# EAGLE design MonoMixer (EAGLE 7.5.0)
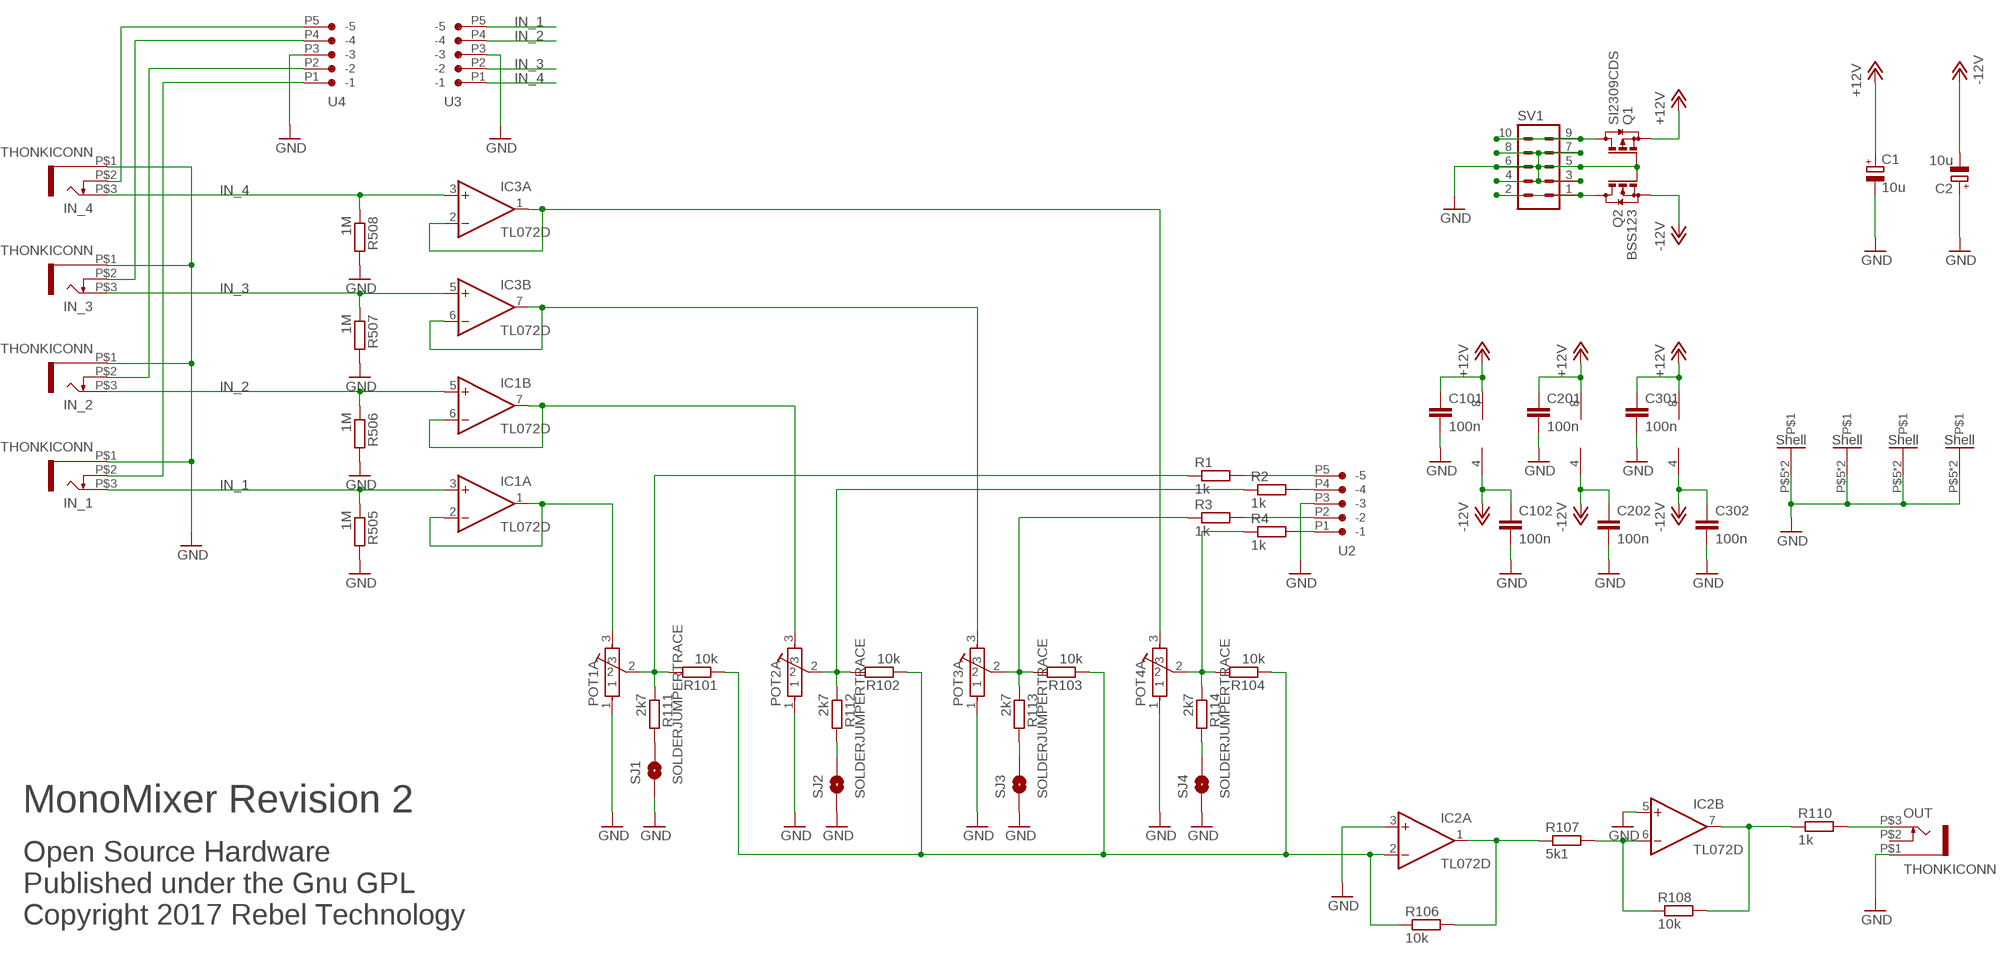
[diagram p0: schematic, sheet 1]

## Parts
C1  10u  CPOL-EU153CLV-0505  [153CLV-0505]
C2  10u  CPOL-EU153CLV-0505  [153CLV-0505]
C101  100n  C-EUC0603  [C0603]
C102  100n  C-EUC0603  [C0603]
C201  100n  C-EUC0603  [C0603]
C202  100n  C-EUC0603  [C0603]
C301  100n  C-EUC0603  [C0603]
C302  100n  C-EUC0603  [C0603]
IC1  TL072D  [SO08]
IC2  TL072D  [SO08]
IC3  TL072D  [SO08]
IN_1  THONKICONN  [THONKICONN]
IN_2  THONKICONN  [THONKICONN]
IN_3  THONKICONN  [THONKICONN]
IN_4  THONKICONN  [THONKICONN]
OUT  THONKICONN  [THONKICONN]
POT1A  POT-ALPS-RK09L1140  [POT-ALPS-RK09L1140]
POT2A  POT-ALPS-RK09L1140  [POT-ALPS-RK09L1140]
POT3A  POT-ALPS-RK09L1140  [POT-ALPS-RK09L1140]
POT4A  POT-ALPS-RK09L1140  [POT-ALPS-RK09L1140]
Q1  SI2309CDS  BSS84  [SOT23]
Q2  BSS123  [SOT23]
R1  1k  R-EU_R0603  [R0603]
R2  1k  R-EU_R0603  [R0603]
R3  1k  R-EU_R0603  [R0603]
R4  1k  R-EU_R0603  [R0603]
R101  10k  R-EU_R0603  [R0603]
R102  10k  R-EU_R0603  [R0603]
R103  10k  R-EU_R0603  [R0603]
R104  10k  R-EU_R0603  [R0603]
R106  10k  R-EU_R0603  [R0603]
R107  5k1  R-EU_R0603  [R0603]
R108  10k  R-EU_R0603  [R0603]
R110  1k  R-EU_R0603  [R0603]
R111  2k7  R-EU_R0603  [R0603]
R112  2k7  R-EU_R0603  [R0603]
R113  2k7  R-EU_R0603  [R0603]
R114  2k7  R-EU_R0603  [R0603]
R505  1M  R-EU_R0603  [R0603]
R506  1M  R-EU_R0603  [R0603]
R507  1M  R-EU_R0603  [R0603]
R508  1M  R-EU_R0603  [R0603]
SJ1  SOLDERJUMPERTRACE  [SJ_2S-TRACE]
SJ2  SOLDERJUMPERTRACE  [SJ_2S-TRACE]
SJ3  SOLDERJUMPERTRACE  [SJ_2S-TRACE]
SJ4  SOLDERJUMPERTRACE  [SJ_2S-TRACE]
SV1  MA05-2  [MA05-2]
U2  CON-JST_PH_5W  [CON-JST_PH_5W]
U3  CON-JST_PH_5W  [CON-JST_PH_5W]
U4  CON-JST_PH_5W  [CON-JST_PH_5W]

## Nets
+12V: C1.+ C101.1 C201.1 C301.1 IC1.8(P:V+) IC2.8(P:V+) IC3.8(P:V+) Q1.2(S)
-12V: C2.- C102.1 C202.1 C302.1 IC1.4(P:V-) IC2.4(P:V-) IC3.4(P:V-) Q2.2(S)
GND: C1.- C2.+ C101.2 C102.2 C201.2 C202.2 C301.2 C302.2 IC2.3(A:+IN) IC2.5(B:+IN) IN_1.P$1 IN_2.P$1 IN_3.P$1 IN_4.P$1 OUT.P$1 POT1A.1 POT1A.P$5 POT1A.P$6 POT2A.1 POT2A.P$5 POT2A.P$6 POT3A.1 POT3A.P$5 POT3A.P$6 POT4A.1 POT4A.P$5 POT4A.P$6 Q1.1(G) Q2.1(G) R505.2 R506.2 R507.2 R508.2 SJ1.1 SJ2.1 SJ3.1 SJ4.1 SV1.3 SV1.4 SV1.5 SV1.6 SV1.7 SV1.8 U2.P3(-3) U3.P3(-3) U4.P3(-3)
IN_1: IC1.3(A:+IN) IN_1.P$3 R505.1 U3.P5(-5)
IN_2: IC1.5(B:+IN) IN_2.P$3 R506.1 U3.P4(-4)
IN_3: IC3.5(B:+IN) IN_3.P$3 R507.1 U3.P2(-2)
IN_4: IC3.3(A:+IN) IN_4.P$3 R508.1 U3.P1(-1)
IN_SW_1: IN_1.P$2 U4.P1(-1)
IN_SW_2: IN_2.P$2 U4.P2(-2)
IN_SW_3: IN_3.P$2 U4.P4(-4)
IN_SW_4: IN_4.P$2 U4.P5(-5)
N$1: Q2.3(D) SV1.1 SV1.2
N$2: R1.2 U2.P5(-5)
N$3: R2.2 U2.P4(-4)
N$4: R3.2 U2.P2(-2)
N$5: R4.2 U2.P1(-1)
N$6: IC2.7(B:OUT) R108.2 R110.1
N$9: OUT.P$3 R110.2
N$11: IC2.2(A:-IN) R101.1 R102.1 R103.1 R104.1 R106.1
N$13: IC2.1(A:OUT) R106.2 R107.1
N$14: Q1.3(D) SV1.9 SV1.10
N$17: R111.2 SJ1.2
N$18: IC2.6(B:-IN) R107.2 R108.1
N$22: R112.2 SJ2.2
N$24: R113.2 SJ3.2
N$25: R114.2 SJ4.2
N$29: POT1A.2 R1.1 R101.2 R111.1
N$35: IC3.1(A:OUT) IC3.2(A:-IN) POT4A.3
N$36: IC3.6(B:-IN) IC3.7(B:OUT) POT3A.3
N$37: IC1.6(B:-IN) IC1.7(B:OUT) POT2A.3
N$38: IC1.1(A:OUT) IC1.2(A:-IN) POT1A.3
N$47: POT4A.2 R4.1 R104.2 R114.1
N$49: POT3A.2 R3.1 R103.2 R113.1
N$51: POT2A.2 R2.1 R102.2 R112.1
Unconnected: OUT.P$2

## Notes on the sheet
- MonoMixer Revision 2
- Open Source Hardware
  Published under the Gnu GPL
  Copyright 2017 Rebel Technology

## Library data of the parts
C1 C2 = rcl:CPOL-EU: POLARIZED CAPACITOR, European symbol
C101 C102 C201 C202 C301 C302 = resistor:C-EU: CAPACITOR, European symbol
IC1-IC3 = linear:TL072: OP AMP
IN_1-IN_4 OUT = Rebel:THONKICONN
POT1A POT2A POT3A POT4A = Rebel:POT-ALPS-RK09L
Q1 = transistor-small-signal:BSS84: P-CHANNEL MOS FET
Q2 = transistor-small-signal:BSS123: N-CHANNEL MOS FET
R1-R4 R101-R104 R106-R108 R110-R114 R505-R508 = resistor:R-EU_: RESISTOR, European symbol
SJ1-SJ4 = SparkFun:SOLDERJUMPER: Solder Jumper Standard SMD solder jumper. Used to automate production. Two varients : Normally Open and Normally Closed are the same, but have different paste layers. NC will have a large amount of paste and should jumper during reflow.
SV1 = con-lstb:MA05-2: PIN HEADER; OC_FARNELL: unknown; OC_NEWARK: unknown
U2-U4 = Rebel:CON-JST_PH_5W

## Board
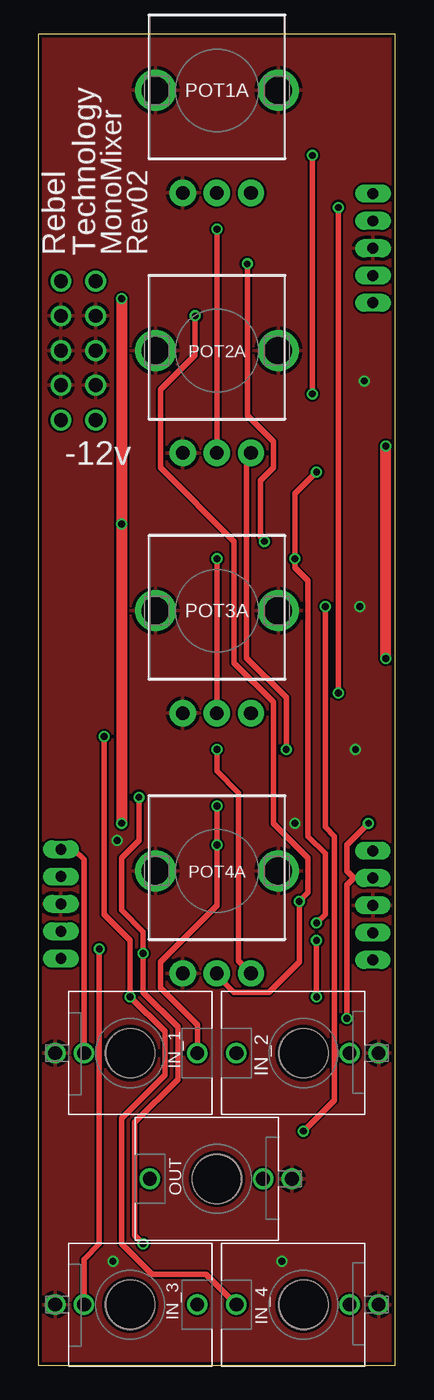
[diagram p1: board, top side]
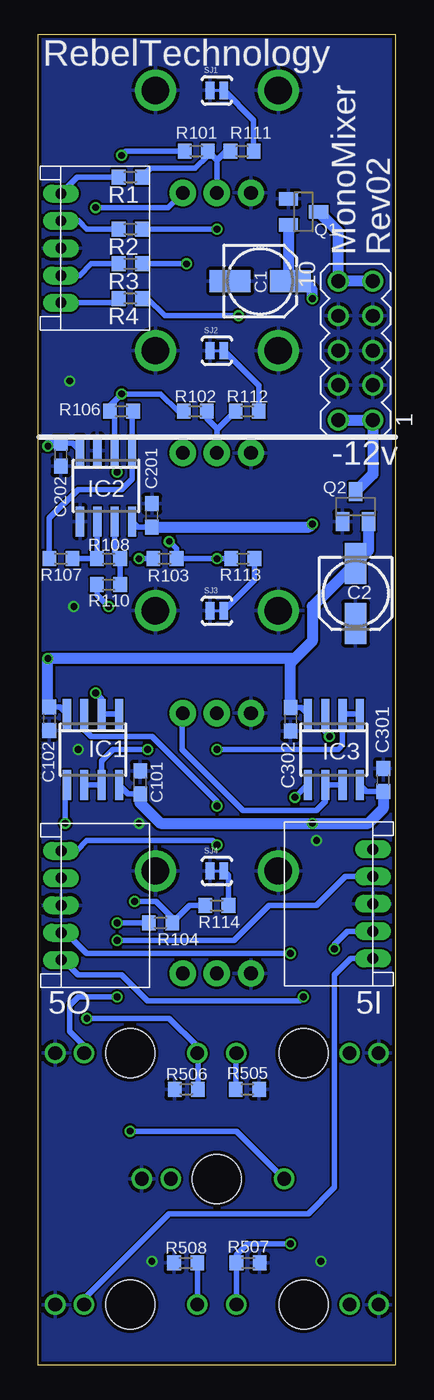
[diagram p2: board, bottom side, seen from below]

Size 26.16 x 97.46 mm. Coordinates in mm from the lower left corner, seen from the top.
Outline: 26.16,0 26.16,97.46 0,97.46 0,0 26.16,0
Copper layers (1*16): Top 0.035mm / dielectric 1.5mm / Bottom 0.035mm
Design rules "SeeedStudio_2layer_DRU_no_angle_20140221": minimum track width 6mil, minimum drill 12mil, track to track 6mil, track to pad 6mil, pad to pad 6mil, via to via 6mil, smd to smd 0mil, copper to edge 10mil, drill to drill 10mil, minimum pad ring 10mil, minimum via ring 6mil, stop-mask expansion 2mil, vias tented up to drill 100mil, thermal gap 10mil

### Footprints (pad centres in the part's own frame; a part is rotated, then mirrored left to right if it is on the bottom)
153CLV-0505 = smd 3 x 1.6: + 2.2,0; - -2.2,0
C0603 = smd 1.1 x 1: 1 -0.85,0; 2 0.85,0
SO08 = smd 0.6 x 2.2: 1 -1.905,-2.6; 2 -0.635,-2.6; 3 0.635,-2.6; 4 1.905,-2.6; 5 1.905,2.6; 6 0.635,2.6; 7 -0.635,2.6; 8 -1.905,2.6
THONKICONN = drill 1: P$1 0,-5.5; P$2 0,-3.38; P$3 0,4.92 | hole 3.6: 0,0
POT-ALPS-RK09L1140 = drill 1 pad 1.93: 1 -2.5,-7.5; 2 0,-7.5; 3 2.5,-7.5 | drill 2: P$5 -4.5,0; P$6 4.5,0
SOT23 = smd 1 x 1.4: 1 -0.95,-1.1; 2 0.95,-1.1; 3 0,1.1
R0603 = smd 1 x 1.1: 1 -0.85,0; 2 0.85,0
SJ_2S-TRACE = smd 0.635 x 1.27: 1 -0.508,0; 2 0.508,0
MA05-2 = drill 1.016: 1 -5.08,-1.27; 2 -5.08,1.27; 3 -2.54,-1.27; 4 -2.54,1.27; 5 0,-1.27; 6 0,1.27; 7 2.54,-1.27; 8 2.54,1.27; 9 5.08,-1.27; 10 5.08,1.27
CON-JST_PH_5W = drill 0.8 long: P1 0,0; P2 -2,0; P3 -4,0; P4 -6,0; P5 -8,0

### Placement (x,y rotation side)
C1  9.91,79.38 0 bottom
C2  2.92,56.52 270 bottom
C101  18.7,42.68 90 bottom
C102  25.37,47.34 270 bottom
C201  17.84,62.23 90 bottom
C202  24.51,66.67 270 bottom
C301  0.89,42.86 90 bottom
C302  7.68,47.31 270 bottom
IC1  22.16,45.09 180 bottom
IC2  21.21,64.39 180 bottom
IC3  4.51,45.09 180 bottom
IN_1  6.73,22.86 270 top
IN_2  19.43,22.86 90 top
IN_3  6.73,4.45 270 top
IN_4  19.43,4.45 90 top
OUT  13.08,13.65 90 top
POT1A  13.08,93.34 0 top
POT2A  13.08,74.3 0 top
POT3A  13.08,55.25 0 top
POT4A  13.08,36.2 0 top
Q1  6.73,84.45 270 bottom
Q2  2.92,62.87 0 bottom
R1  19.43,87 180 bottom
R2  19.43,83.19 180 bottom
R3  19.43,80.64 180 bottom
R4  19.43,78.11 180 bottom
R101  14.59,88.89 0 bottom
R102  14.67,69.85 0 bottom
R103  16.89,59.05 0 bottom
R104  17.21,32.39 0 bottom
R106  20.07,69.85 0 bottom
R107  24.51,59.05 0 bottom
R108  21.02,59.05 0 bottom
R110  21.02,57.15 180 bottom
R111  11.24,88.89 0 bottom
R112  10.86,69.85 0 bottom
R113  11.18,59.05 0 bottom
R114  13.08,33.66 0 bottom
R505  10.84,20.2 0 bottom
R506  15.32,20.2 180 bottom
R507  10.79,7.49 0 bottom
R508  15.37,7.49 180 bottom
SJ1  13.08,93.34 0 bottom
SJ2  13.08,74.3 0 bottom
SJ3  13.08,55.25 0 bottom
SJ4  13.08,36.2 0 bottom
SV1  2.92,74.3 90 bottom
U2  24.51,77.79 270 bottom
U3  24.5,29.68 270 bottom
U4  1.65,37.78 90 bottom

### Tracks (layer width: path | path; a pad name or v marks a point on that pad's centre or on a via)
+12V  (via drill 0.5)
  Top 0.813: v6.1,78.11 v6.1,61.59 v6.1,39.69
  Bottom 0.406: C301.1 2.13,42.01 IC3.8 | C201.1 18.89,61.38 IC2.8 | C101.1 19.6,41.83 IC1.8
  Bottom 0.813: C201.1 6.31,61.38 v6.1,61.59 | C101.1 18.71,41.19 17.21,39.69 v6.1,39.69 1.97,39.69 0.89,40.77 C301.1 | v6.1,78.11 6.1,78.74 6.73,79.38 C1.+ 7.83,79.5 Q1.2
-12V  (via drill 0.5)
  Top 0.813: v25.46,51.75 v25.46,67.31
  Bottom 0.406: 24.07,48.13 IC1.4 24.57,48.19 C102.1 25.46,48.28 | C202.1 23.65,67.53 IC2.4 | IC3.4 6.89,48.16 C302.1
  Bottom 0.813: Q2.2 1.97,59.67 C2.- 2.92,58.42 3.24,58.42 6.1,55.56 6.1,53.02 7.37,51.75 | 7.37,51.75 v25.46,51.75 25.46,48.28 | C302.1 7.68,51.44 7.37,51.75 | C202.1 25.25,67.53 v25.46,67.31
GND  (via drill 0.5)
  other vias: 17.84,7.62 5.46,7.62 5.78,38.42 18.8,39.69 23.24,45.09 23.56,55.56 23.88,72.07
  pour Bottom: -4.7,-3.17 30.86,-3.17 30.86,97.16 -4.7,97.16
  pour Top: -3.43,-1.9 32.13,-1.9 32.13,98.42 -3.43,98.42
IN_1  (via drill 0.5)
  Top 0.406: v13.08,40.96 v13.08,38.1 13.08,33.66 8.95,29.53 8.95,27.62 11.65,24.93 IN_1.P$3
  Bottom 0.406: IC1.3 22.8,46.55 22.29,46.04 17.84,46.04 13.08,41.28 v13.08,40.96 | R505.1 11.69,22.82 IN_1.P$3 | U3.P5 23.35,37.68 22.61,38.42 13.4,38.42 v13.08,38.1
IN_2  (via drill 0.5)
  Top 0.406: v24.19,39.69 22.61,38.1 22.61,36.2 23.13,35.68 | U3.P4 23.13,35.68 | v22.61,25.4 22.61,35.16 23.13,35.68
  Bottom 0.406: R506.1 14.47,22.82 IN_2.P$3 14.51,23.34 16.57,25.4 v22.61,25.4 | v24.19,39.69 24.19,42.36 IC1.5
IN_3  (via drill 0.5)
  Top 0.406: v7.37,41.59 7.37,38.42 6.1,37.15 6.1,33.34 7.68,31.75 v7.68,30.16 7.68,27.3 10.22,24.77 10.22,20.95 7.05,17.78 7.05,9.52 v7.68,8.89
  Bottom 0.406: v7.68,8.89 10.86,8.89 11.65,8.1 R507.1 IN_3.P$3 | IC3.5 6.47,42.48 v7.37,41.59 | U3.P2 24.12,31.68 22.61,30.16 v7.68,30.16
IN_4  (via drill 0.5)
  Top 0.406: v4.83,46.04 4.83,33.02 6.73,31.11 v6.73,26.99 9.27,24.45 9.27,21.27 6.1,18.1 6.1,8.89 8.32,6.67 12.29,6.67 IN_4.P$3
  Bottom 0.406: IC3.3 5.14,46.36 v4.83,46.04 | IN_4.P$3 R508.1 | U3.P1 24.34,29.68 23.24,28.57 20.07,28.57 18.16,26.67 7.05,26.67 v6.73,26.99
IN_SW_1
  Top 0.406: IN_1.P$2 3.35,37.04 2.6,37.78 U4.P1
IN_SW_2  (via drill 0.5)
  Top 0.406: v20.38,26.99 v20.38,31.11
  Bottom 0.406: IN_2.P$2 22.81,23.38 23.88,24.45 23.88,26.35 23.24,26.99 v20.38,26.99 | v20.38,31.11 11.81,31.11 9.27,33.66 5.78,33.66 3.65,35.78 U4.P2
IN_SW_3  (via drill 0.5)
  Top 0.406: v4.47,30.48 4.47,8.89 3.35,7.77 IN_3.P$2
  Bottom 0.406: U4.P4 3.52,31.78 4.47,30.84 v4.47,30.48
IN_SW_4
  Bottom 0.406: IN_4.P$2 22.81,4.88 16.57,11.11 6.38,11.11 4.47,13.02 4.47,28.57 3.26,29.78 U4.P5
N$1
  Bottom 0.813: Q2.3 1.65,65.23 SV1.1 SV1.2
N$2
  Bottom 0.406: R1.2 23.3,87 U2.P5
N$3
  Bottom 0.406: U2.P4 23.21,83.79 22.61,83.19 R2.2
N$4
  Bottom 0.406: R3.2 22.29,80.64 23.15,79.79 U2.P2
N$5
  Bottom 0.406: U2.P1 20.6,77.79 R4.2
N$6
  Bottom 0.406: R110.1 R108.2 20.57,59.46 IC2.7
N$9  (via drill 0.5)
  Top 0.406: v21.02,55.56 21.02,39.41 21.69,38.73 21.69,19.41 v19.43,17.14
  Bottom 0.406: R110.2 21.87,56.41 v21.02,55.56 | v19.43,17.14 11.65,17.14 OUT.P$3
N$11  (via drill 0.5)
  Top 0.406: v20.38,32.39 21.02,33.02 21.02,37.47 19.75,38.73 19.75,57.47 18.8,58.42 v18.8,59.05 18.8,63.82 v20.38,65.41 | v20.07,88.58 v20.07,71.12
  Bottom 0.406: R102.1 15.94,69.85 17.21,71.12 v20.07,71.12 20.92,70.27 R106.1 20.57,69.51 IC2.2 20.57,65.59 v20.38,65.41 | R101.1 19.75,88.89 v20.07,88.58 | v20.38,32.39 R104.1 | v18.8,59.05 R103.1
N$13
  Bottom 0.406: R106.2 19.3,69.76 IC2.1 19.3,64.9 20.07,64.14 23.24,64.14 25.36,62.02 R107.1
N$14
  Bottom 0.813: SV1.9 SV1.10 4.19,83.02 Q1.3
N$17
  Bottom 0.406: R111.2 10.39,91.16 SJ1.2
N$18
  Bottom 0.406: IC2.6 21.84,59.08 R108.1 R107.2
N$22
  Bottom 0.406: R112.2 10.01,71.73 SJ2.2
N$24
  Bottom 0.406: R113.2 10.33,57.49 SJ3.2
N$25
  Bottom 0.406: R114.2 12.23,35.85 SJ4.2
N$29
  Bottom 0.406: POT1A.2 13.08,88.23 | 13.08,88.23 R101.2 13.74,88.56 14.67,87.63 17.95,87.63 R1.1 | R111.1 12.42,88.89 13.08,88.23
N$35  (via drill 0.5)
  Top 0.406: v13.08,45.09 13.08,43.5 14.67,41.91 14.67,29.61 POT4A.3
  Bottom 0.406: IC3.1 IC3.2 3.87,45.4 4.19,45.09 v13.08,45.09
N$36
  Bottom 0.406: IC3.7 IC3.6 5.14,41.28 5.78,40.64 11.18,40.64 15.62,45.09 15.62,47.71 POT3A.3
N$37  (via drill 0.5)
  Top 0.406: v18.16,45.09 18.16,48.9 15.26,51.79 15.26,66.32 15.58,66.64 POT2A.3
  Bottom 0.406: IC1.6 IC1.7 21.53,44.26 20.7,45.09 v18.16,45.09
N$38  (via drill 0.5)
  Top 0.406: v21.97,84.77 v21.97,49.21
  Bottom 0.406: IC1.1 IC1.2 21.53,48.77 v21.97,49.21 | v21.97,84.77 16.65,84.77 POT1A.3
N$47  (via drill 0.5)
  Top 0.406: v11.49,76.84 11.49,73.98 8.95,71.44 8.95,65.72 14.35,60.33 14.35,51.44 17.21,48.58 17.21,39.69 19.75,37.15 19.75,34.61 v19.11,33.97 19.11,29.53 16.89,27.3 14.35,27.3 13.08,28.57 POT4A.2
  Bottom 0.406: v19.11,33.97 17.53,33.97 16.36,32.8 R104.2 15.09,33.66 R114.1 | R4.1 18.16,78.11 16.89,76.84 v11.49,76.84
N$49  (via drill 0.5)
  Top 0.406: POT3A.2 v13.08,59.05 | v15.3,80.64 15.3,69.53 17.21,67.63 17.21,65.72 16.26,64.77 16.26,60.64 v16.57,60.33
  Bottom 0.406: R113.1 v13.08,59.05 R103.2 16.04,59.79 v16.57,60.33 | R3.1 v15.3,80.64
N$51  (via drill 0.5)
  Top 0.406: v13.08,83.19 POT2A.2
  Bottom 0.406: POT2A.2 13.08,68.48 13.03,68.53 | 13.03,68.53 R112.1 | 13.03,68.53 13.82,69.32 R102.2 13.82,70.06 | R2.1 v13.08,83.19

### Text on the board
tPlace: Rebel | Technology | MonoMixer | Rev02 | -12v
bPlace: RebelTechnology | Rev02 | MonoMixer | -12v | 5I | 5O